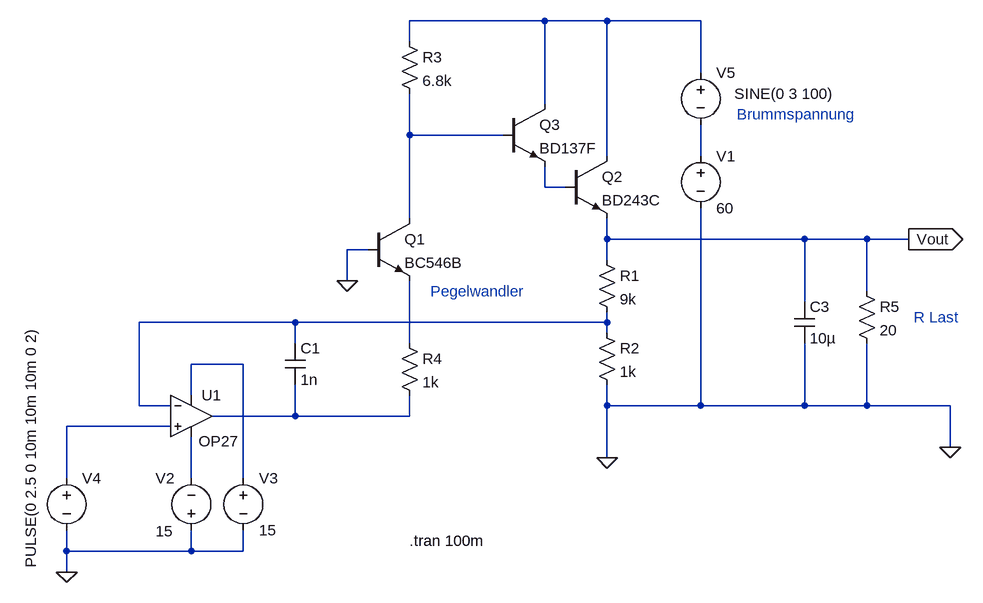
[diagram p0: schematic trans_pegelwandler.asc]
trans_pegelwandler.asc, the LTspice schematic file:
Version 4
SHEET 1 1400 1076
WIRE 336 -320 128 -320
WIRE 432 -320 336 -320
WIRE 576 -320 432 -320
WIRE 128 -288 128 -320
WIRE 576 -240 576 -320
WIRE 336 -192 336 -320
WIRE 128 -144 128 -208
WIRE 272 -144 128 -144
WIRE 432 -112 432 -320
WIRE 576 -112 576 -160
WIRE 336 -64 336 -96
WIRE 368 -64 336 -64
WIRE 128 -16 128 -144
WIRE 432 16 432 -16
WIRE 736 16 432 16
WIRE 832 16 736 16
WIRE 896 16 832 16
WIRE 64 32 32 32
WIRE 432 48 432 16
WIRE 32 80 32 32
WIRE 832 96 832 16
WIRE 736 112 736 16
WIRE -48 144 -288 144
WIRE 432 144 432 128
WIRE 432 144 -48 144
WIRE 432 160 432 144
WIRE -48 176 -48 144
WIRE 128 176 128 80
WIRE -128 208 -208 208
WIRE -208 256 -208 208
WIRE -288 272 -288 144
WIRE -240 272 -288 272
WIRE 432 272 432 240
WIRE 576 272 576 -32
WIRE 576 272 432 272
WIRE 736 272 736 176
WIRE 736 272 576 272
WIRE 832 272 832 176
WIRE 832 272 736 272
WIRE 960 272 832 272
WIRE -48 288 -48 240
WIRE -48 288 -176 288
WIRE 128 288 128 256
WIRE 128 288 -48 288
WIRE -240 304 -400 304
WIRE 960 336 960 272
WIRE 432 352 432 272
WIRE -400 384 -400 304
WIRE -208 384 -208 320
WIRE -128 384 -128 208
WIRE -400 496 -400 464
WIRE -208 496 -208 464
WIRE -208 496 -400 496
WIRE -128 496 -128 464
WIRE -128 496 -208 496
WIRE -400 528 -400 496
FLAG 432 352 0
FLAG -400 528 0
FLAG 32 80 0
FLAG 896 16 Vout
IOPIN 896 16 Out
FLAG 960 336 0
SYMBOL npn 64 -16 R0
SYMATTR InstName Q1
SYMATTR Value BC546B
SYMBOL res 112 -304 R0
SYMATTR InstName R3
SYMATTR Value 6.8k
SYMBOL voltage -208 480 R180
WINDOW 123 0 0 Left 0
WINDOW 39 0 0 Left 0
WINDOW 0 26 96 Left 2
WINDOW 3 28 15 Left 2
SYMATTR InstName V2
SYMATTR Value 15
SYMBOL voltage -400 368 R0
WINDOW 123 0 0 Left 0
WINDOW 39 0 0 Left 0
WINDOW 3 -55 -217 VRight 2
SYMATTR Value PULSE(0 2.5 0 10m 10m 10m 0 2)
SYMATTR InstName V4
SYMBOL voltage -128 368 R0
WINDOW 123 0 0 Left 0
WINDOW 39 0 0 Left 0
SYMATTR InstName V3
SYMATTR Value 15
SYMBOL Opamps\\OP27 -208 224 R0
WINDOW 3 11 103 Left 2
SYMATTR InstName U1
SYMBOL voltage 576 -128 R0
WINDOW 123 0 0 Left 0
WINDOW 39 0 0 Left 0
SYMATTR InstName V1
SYMATTR Value 60
SYMBOL npn 368 -112 R0
SYMATTR InstName Q2
SYMATTR Value BD243C
SYMBOL res 416 32 R0
SYMATTR InstName R1
SYMATTR Value 9k
SYMBOL res 416 144 R0
SYMATTR InstName R2
SYMATTR Value 1k
SYMBOL res 112 160 R0
SYMATTR InstName R4
SYMATTR Value 1k
SYMBOL cap -64 176 R0
SYMATTR InstName C1
SYMATTR Value 1n
SYMBOL npn 272 -192 R0
SYMATTR InstName Q3
SYMATTR Value BD137F
SYMBOL cap 720 112 R0
SYMATTR InstName C3
SYMATTR Value 10µ
SYMATTR SpiceLine Rser=1
SYMBOL res 816 80 R0
SYMATTR InstName R5
SYMATTR Value 20
SYMBOL voltage 576 -256 R0
WINDOW 123 0 0 Left 0
WINDOW 39 0 0 Left 0
WINDOW 3 52 48 Left 2
SYMATTR InstName V5
SYMATTR Value SINE(0 3 100)
TEXT 128 480 Left 2 !.tran 100m
TEXT 904 136 Left 2 ;R Last
TEXT 160 96 Left 2 ;Pegelwandler
TEXT 632 -176 Left 2 ;Brummspannung

The netlist it stands for:
* trans_pegelwandler.asc
Q1 N002 0 N006 0 BC546B
R3 N001 N002 6.8k
V2 0 N010 15
V4 N009 0 PULSE(0 2.5 0 10m 10m 10m 0 2)
V3 N007 0 15
XU1 N009 N005 N007 N010 N008 OP27  ; pins In+ In- V+ V- OUT
V1 N003 0 60
Q2 N001 N004 Vout 0 BD243C
R1 Vout N005 9k
R2 N005 0 1k
R4 N006 N008 1k
C1 N005 N008 1n
Q3 N001 N002 N004 0 BD137F
C3 Vout 0 10µ Rser=1
R5 Vout 0 20
V5 N001 N003 SINE(0 3 100)
.model NPN NPN
.model PNP PNP
.lib standard.bjt
.tran 100m
* R Last
* Pegelwandler
* Brummspannung
.lib ADI.lib
.backanno
.end